# Altium project 2.3 - 28375D_Control_Card_2023.6.7.PrjPcb
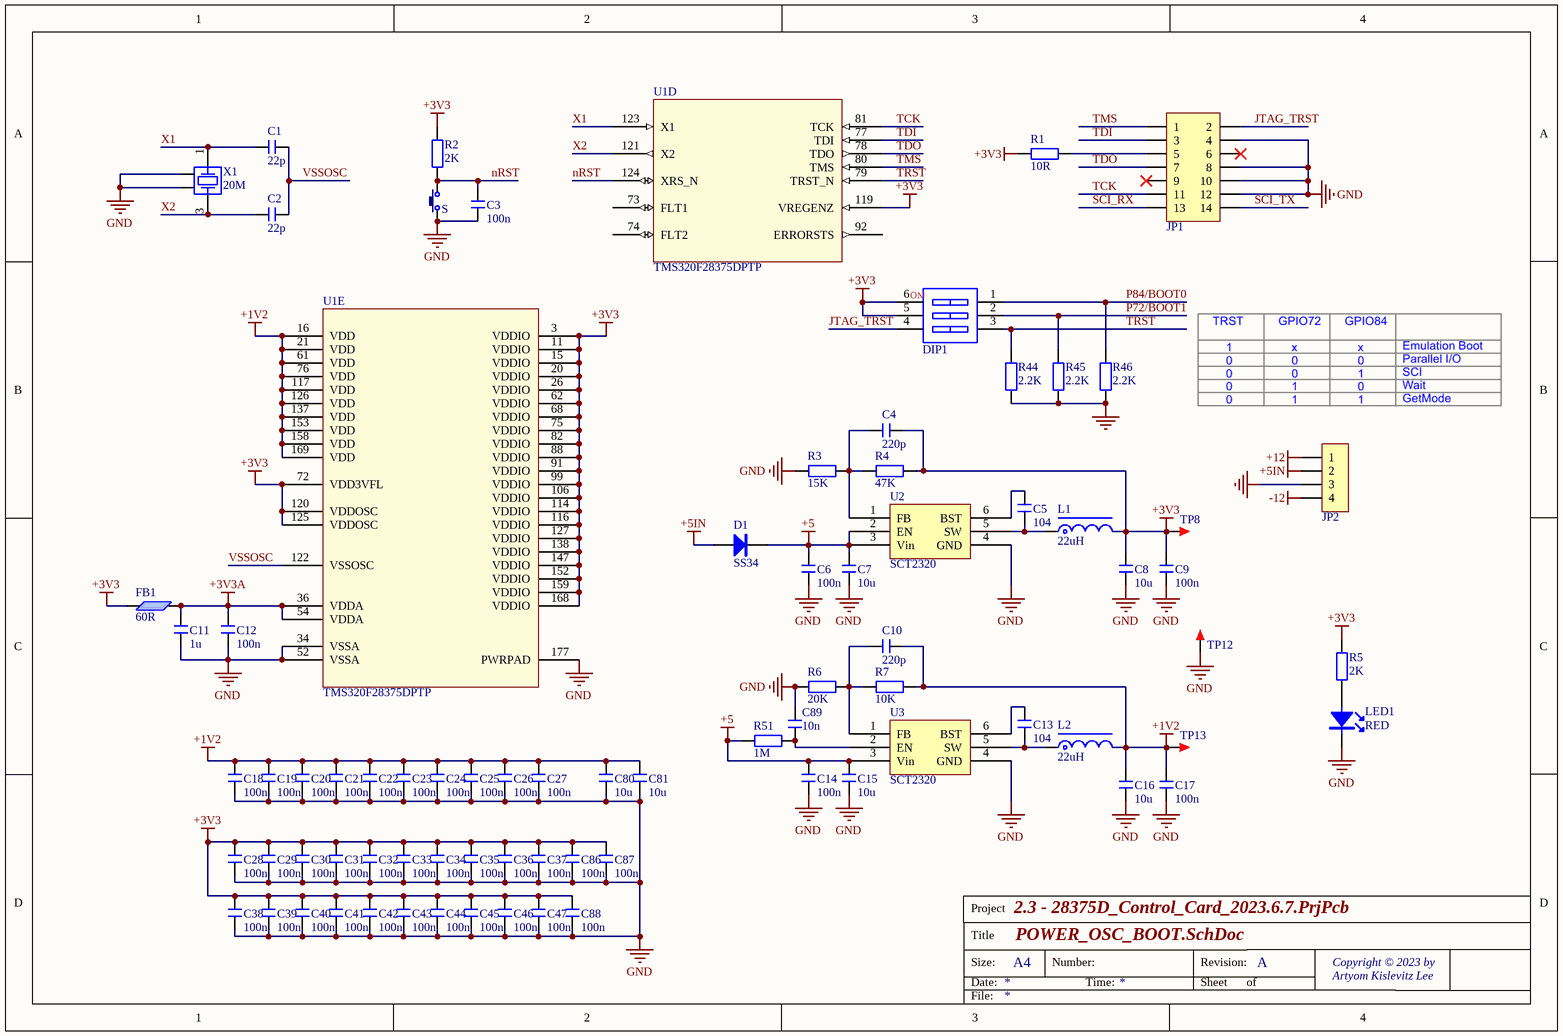
[diagram p0: POWER_OSC_BOOT.SchDoc]
5 sheets, 208 parts. Net scope: global (net labels, ports and power ports of the same name join across sheets).
Board file: 28375D_Control_Card_2023.6.7.PcbDoc
Sheets:
  POWER_OSC_BOOT.SchDoc
  AIO.SchDoc
  DIO.SchDoc
  CONDITIONING.SchDoc
  CONNECTOR_BUFFER.SchDoc

## Sheet POWER_OSC_BOOT.SchDoc
size A4; DrawnBy: Copyright © 2023 by; Engineer: Artyom Kislevitz Lee; Revision: A

### Parts
C1  22p  [C 0805_L]
C2  22p  [C 0805_L]
C3  100n  [C 0805_L]
C4  220p  [C 0805_L]
C5  104  [C 0805_L]
C6  100n  [C 0805_L]
C7  10u  [C 1210_L]
C8  10u  [C 1210_L]
C9  100n  [C 0805_L]
C10  220p  [C 0805_L]
C11  1u  [C 0805_L]
C12  100n  [C 0805_L]
C13  104  [C 0805_L]
C14  100n  [C 0805_L]
C15  10u  [C 1210_L]
C16  10u  [C 1210_L]
C17  100n  [C 0805_L]
C18  100n  [C 0603_L]
C19  100n  [C 0603_L]
C20  100n  [C 0603_L]
C21  100n  [C 0603_L]
C22  100n  [C 0603_L]
C23  100n  [C 0603_L]
C24  100n  [C 0603_L]
C25  100n  [C 0603_L]
C26  100n  [C 0603_L]
C27  100n  [C 0603_L]
C28  100n  [C 0603_L]
C29  100n  [C 0603_L]
C30  100n  [C 0603_L]
C31  100n  [C 0603_L]
C32  100n  [C 0603_L]
C33  100n  [C 0603_L]
C34  100n  [C 0603_L]
C35  100n  [C 0603_L]
C36  100n  [C 0603_L]
C37  100n  [C 0603_L]
C38  100n  [C 0603_L]
C39  100n  [C 0603_L]
C40  100n  [C 0603_L]
C41  100n  [C 0603_L]
C42  100n  [C 0603_L]
C43  100n  [C 0603_L]
C44  100n  [C 0603_L]
C45  100n  [C 0603_L]
C46  100n  [C 0603_L]
C47  100n  [C 0603_L]
C80  10u  [C 0805_L]
C81  10u  [C 0805_L]
C86  100n  [C 0603_L]
C87  100n  [C 0603_L]
C88  100n  [C 0603_L]
C89  10n  [C 0805_L]
D1  SS34  [SMA]
DIP1  SW-3P  [CSW1.27 SMD-3P]  (value not drawn)
FB1  60R  [R 0805_L]
JP1  Header 2X7  [IDC2.54-LI-2x7P]  (value not drawn)
JP2  HDR-1X4  [KF2510-LI-4P]  (value not drawn)
L1  22uH  [CDRH74]
L2  22uH  [CDRH74]
LED1  RED  [LED 0805R]
R1  10R  [R 0805_L]
R2  2K  [R 0805_L]
R3  15K  [R 0805_L]
R4  47K  [R 0805_L]
R5  2K  [R 0805_L]
R6  20K  [R 0805_L]
R7  10K  [R 0805_L]
R44  2.2K  [R 0805_L]
R45  2.2K  [R 0805_L]
R46  2.2K  [R 0805_L]
R51  1M  [R 0805_L]
S  3x6x5  [TSW DIP-3*6*4.3]  (value not drawn)
TP8  TEST  [TEST 1.6]  (value not drawn)
TP12  TEST  [TEST 1.6]  (value not drawn)
TP13  TEST  [TEST 1.6]  (value not drawn)
U1  TMS320F28375DPTP  [LQFP176-E 24x24_N]  (parts D,E of 5)
U2  SCT2320  [SOT23-6]
U3  SCT2320  [SOT23-6]
X1  20M  [OSC 3225-4P]

### Nets
+1V2: C10.2 C16.2 C17.2 C18.2 C19.2 C20.2 C21.2 C22.2 C23.2 C24.2 C25.2 C26.2 C27.2 C80.2 C81.2 L2.2 R7.2 TP13.1 U1.16(VDD) U1.21(VDD) U1.61(VDD) U1.76(VDD) U1.117(VDD) U1.126(VDD) U1.137(VDD) U1.153(VDD) U1.158(VDD) U1.169(VDD)
+3V3: C4.2 C8.2 C9.2 C28.2 C29.2 C30.2 C31.2 C32.2 C33.2 C34.2 C35.2 C36.2 C37.2 C38.2 C39.2 C40.2 C41.2 C42.2 C43.2 C44.2 C45.2 C46.2 C47.2 C86.2 C87.2 C88.2 DIP1.5 DIP1.6 FB1.1 L1.2 R1.2 R2.2 R4.2 R5.2 TP8.1 U1.3(VDDIO) U1.11(VDDIO) U1.15(VDDIO) U1.20(VDDIO) U1.26(VDDIO) U1.62(VDDIO) U1.68(VDDIO) U1.72(VDD3VFL) U1.75(VDDIO) U1.82(VDDIO) U1.88(VDDIO) U1.91(VDDIO) U1.99(VDDIO) U1.106(VDDIO) U1.114(VDDIO) U1.116(VDDIO) U1.119(VREGENZ) U1.120(VDDOSC) U1.125(VDDOSC) U1.127(VDDIO) U1.138(VDDIO) U1.147(VDDIO) U1.152(VDDIO) U1.159(VDDIO) U1.168(VDDIO)
+3V3A: C11.2 C12.2 FB1.2 U1.36(VDDA) U1.54(VDDA)
+5: C6.2 C7.2 C14.2 C15.2 D1.2(K) R51.1 U2.2(EN) U2.3(Vin) U3.3(Vin)
+5IN: D1.1(A) JP2.2
+12: JP2.1
-12: JP2.4
GND: C3.1 C6.1 C7.1 C8.1 C9.1 C11.1 C12.1 C14.1 C15.1 C16.1 C17.1 C18.1 C19.1 C20.1 C21.1 C22.1 C23.1 C24.1 C25.1 C26.1 C27.1 C28.1 C29.1 C30.1 C31.1 C32.1 C33.1 C34.1 C35.1 C36.1 C37.1 C38.1 C39.1 C40.1 C41.1 C42.1 C43.1 C44.1 C45.1 C46.1 C47.1 C80.1 C81.1 C86.1 C87.1 C88.1 C89.2 JP1.4 JP1.8 JP1.10 JP1.12 JP2.3 LED1.2(K) R3.1 R6.1 R44.2 R45.2 R46.2 S.1 TP12.1 U1.34(VSSA) U1.52(VSSA) U1.177(PWRPAD) U2.4(GND) U3.4(GND) X1.2 X1.4
JTAG_TRST: DIP1.4 JP1.2
nRST: C3.2 R2.1 S.2 U1.124(XRS_N)
P72/BOOT1: DIP1.2 R45.1
P84/BOOT0: DIP1.1 R46.1
SCI_RX: JP1.13
SCI_TX: JP1.14
TCK: JP1.11 U1.81(TCK)
TDI: JP1.3 U1.77(TDI)
TDO: JP1.7 U1.78(TDO)
TMS: JP1.1 U1.80(TMS)
TRST: DIP1.3 R44.1 U1.79(TRST_N)
VSSOSC: C1.1 C2.1 U1.122(VSSOSC)
X1: C1.2 U1.123(X1) X1.1
X2: C2.2 U1.121(X2) X1.3
NetC4_1: C4.1 R3.2 R4.1 U2.1(FB)
NetC5_1: C5.1 U2.6(BST)
NetC5_2: C5.2 L1.1 U2.5(SW)
NetC10_1: C10.1 R6.2 R7.1 U3.1(FB)
NetC13_1: C13.1 U3.6(BST)
NetC13_2: C13.2 L2.1 U3.5(SW)
NetC89_1: C89.1 R51.2 U3.2(EN)
NetJP1_5: JP1.5 R1.1
NetLED1_1: LED1.1(A) R5.1

Not connected (* = marked no-connect by the designer): JP1 6* 9*; U1 73(FLT1) 74(FLT2) 92(ERRORSTS)

### Notes on the sheet
- Project
- Title
- Size:
- Date:
- A4
- Number:
- Time:
- Revision:
- Sheet
- of
- Copyright © 2023 by
- Artyom Kislevitz Lee
- File:
- (in symbol SW-3P) NO

### Library data of the parts
C1-C47 C80 C81 C86-C89 = C: 贴片电容; 淘宝ID: 小糖豆的小窝窝; BOM名称: 贴片电容; 下单链接: https://item.taobao.com/item.htm?ft=t&id=613637044352
D1 = 1N4007: 整流二极管; 淘宝ID: 小糖豆的小窝窝; BOM名称: 整流二极管; 下单链接: https://item.taobao.com/item.htm?ft=t&id=613637044352
DIP1 = SW-3P: 3路编码开关; 淘宝ID: 小糖豆的小窝窝; BOM名称: 3路编码开关; 下单链接: https://item.taobao.com/item.htm?ft=t&id=613637044352
FB1 = FB: 磁珠; BOM名称: 贴片磁珠
JP1 = Header 7X2: 7*2P接插件; 淘宝ID: 小糖豆的小窝窝; BOM名称: 7*2P接插件; 下单链接: https://item.taobao.com/item.htm?ft=t&id=613637044352
JP2 = Header 4: 4P接插件; 淘宝ID: 小糖豆的小窝窝; BOM名称: 4P接插件; 下单链接: https://item.taobao.com/item.htm?ft=t&id=613637044352
L1 L2 = L-CDRH: 功率屏蔽电感; 淘宝ID: 小糖豆的小窝窝; BOM名称: 功率屏蔽电感; 下单链接: https://item.taobao.com/item.htm?ft=t&id=613637044352
LED1 = LED-SMD: 贴片LED; 淘宝ID: 小糖豆的小窝窝; BOM名称: 贴片LED; 下单链接: https://item.taobao.com/item.htm?ft=t&id=613637044352
R1-R7 R44-R46 R51 = R: 贴片电阻; 淘宝ID: 小糖豆的小窝窝; BOM名称: 贴片电阻; 下单链接: https://item.taobao.com/item.htm?ft=t&id=613637044352
S = TSW 3x6: 3x6轻触开关; 淘宝ID: 小糖豆的小窝窝; BOM名称: 3x6轻触开关; 下单链接: https://item.taobao.com/item.htm?ft=t&id=613637044352
TP8 TP12 TP13 = TEST: 测试点; 淘宝ID: 小糖豆的小窝窝; BOM名称: 测试点; 下单链接: https://item.taobao.com/item.htm?ft=t&id=613637044352
U1 = TMS320F28377DPTP: DSP 176; Manufacturer: Texas Instruments; CompType: IC; PIN_COUNT: 177; PartNumber: TMS320F28377DPTP; PackageReference: PTP0176F; MountType: SMT; RoHS: Y; RefDes: RefDes; Type: DEV; Value: Value
U2 U3 = SCT2330
X1 = XTAL-4P: 4脚无源晶振; 淘宝ID: 小糖豆的小窝窝; BOM名称: 4脚无源晶振; 下单链接: https://item.taobao.com/item.htm?ft=t&id=613637044352

## Sheet AIO.SchDoc
size A4; DrawnBy: Copyright © 2023 by; Engineer: Artyom Kislevitz Lee; Revision: A
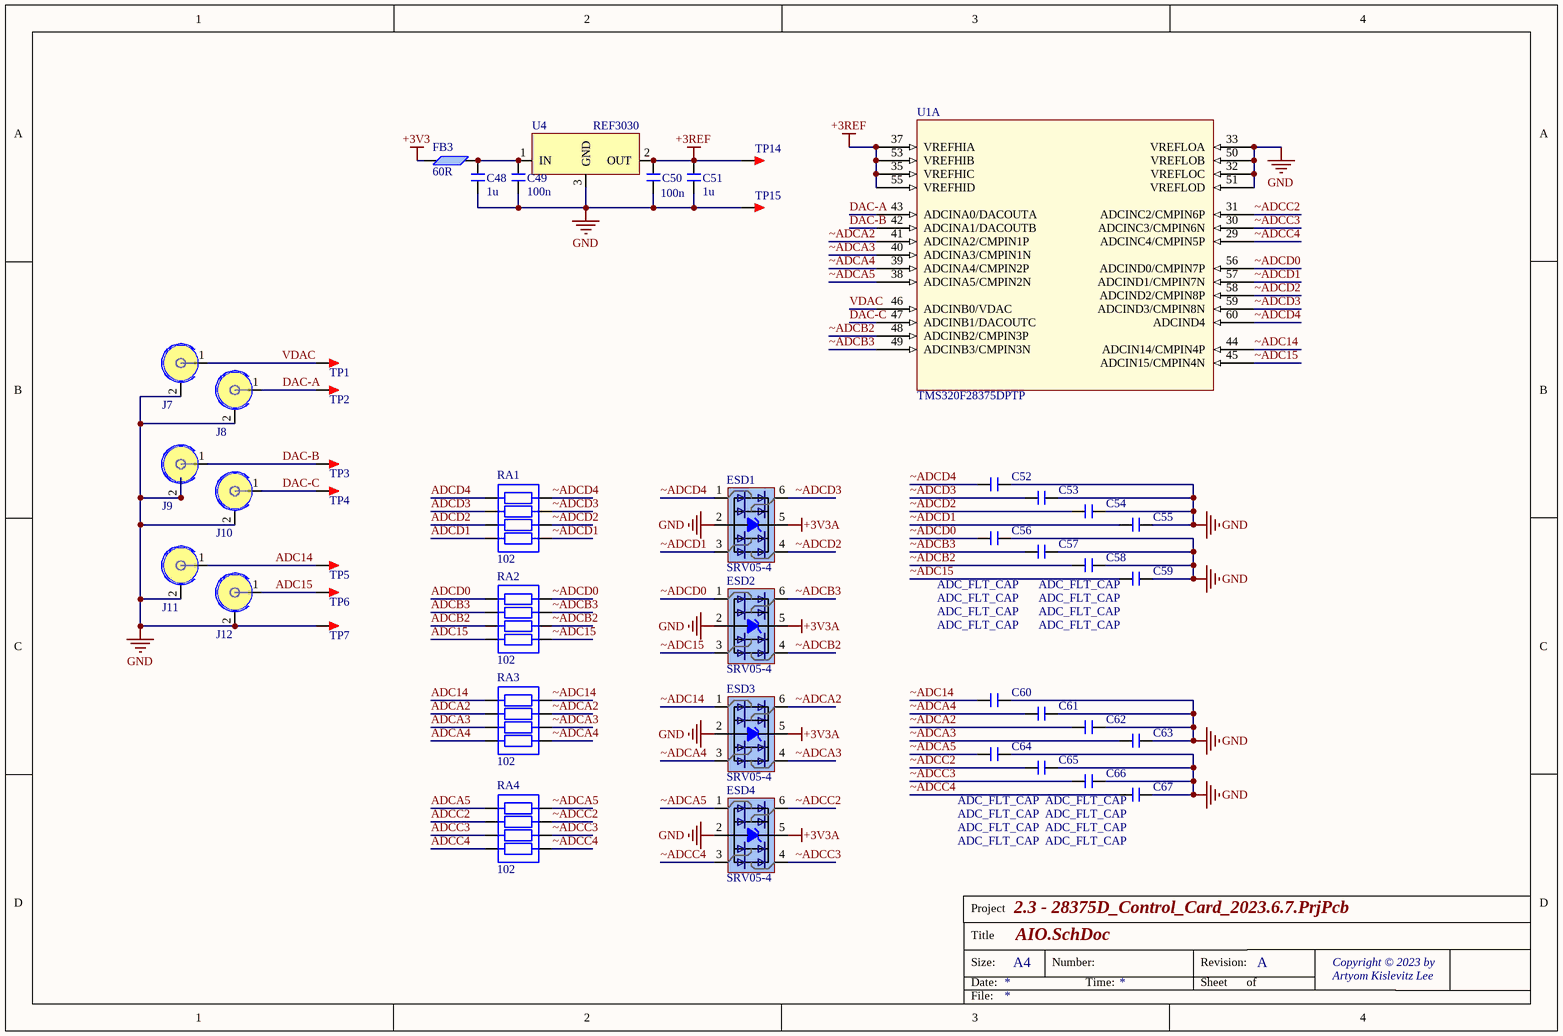
[diagram p1: AIO.SchDoc]

### Parts
C48  1u  [C 0805_L]
C49  100n  [C 0805_L]
C50  100n  [C 0805_L]
C51  1u  [C 0805_L]
C52  ADC_FLT_CAP  [C 0805_L]
C53  ADC_FLT_CAP  [C 0805_L]
C54  ADC_FLT_CAP  [C 0805_L]
C55  ADC_FLT_CAP  [C 0805_L]
C56  ADC_FLT_CAP  [C 0805_L]
C57  ADC_FLT_CAP  [C 0805_L]
C58  ADC_FLT_CAP  [C 0805_L]
C59  ADC_FLT_CAP  [C 0805_L]
C60  ADC_FLT_CAP  [C 0805_L]
C61  ADC_FLT_CAP  [C 0805_L]
C62  ADC_FLT_CAP  [C 0805_L]
C63  ADC_FLT_CAP  [C 0805_L]
C64  ADC_FLT_CAP  [C 0805_L]
C65  ADC_FLT_CAP  [C 0805_L]
C66  ADC_FLT_CAP  [C 0805_L]
C67  ADC_FLT_CAP  [C 0805_L]
ESD1  SRV05-4  [SOT23-6L]
ESD2  SRV05-4  [SOT23-6L]
ESD3  SRV05-4  [SOT23-6L]
ESD4  SRV05-4  [SOT23-6L]
FB3  60R  [R 0805_L]
J7  射频连接器  [IPEX-1]  (value not drawn)
J8  射频连接器  [IPEX-1]  (value not drawn)
J9  射频连接器  [IPEX-1]  (value not drawn)
J10  射频连接器  [IPEX-1]  (value not drawn)
J11  射频连接器  [IPEX-1]  (value not drawn)
J12  射频连接器  [IPEX-1]  (value not drawn)
RA1  102  [RCA-8P4R-0603]
RA2  102  [RCA-8P4R-0603]
RA3  102  [RCA-8P4R-0603]
RA4  102  [RCA-8P4R-0603]
TP1  TEST TP  [TEST TP1.4_W]  (value not drawn)
TP2  TEST TP  [TEST TP1.4_Y]  (value not drawn)
TP3  TEST TP  [TEST TP1.4_Y]  (value not drawn)
TP4  TEST TP  [TEST TP1.4_Y]  (value not drawn)
TP5  TEST TP  [TEST TP1.4_G]  (value not drawn)
TP6  TEST TP  [TEST TP1.4_G]  (value not drawn)
TP7  TEST TP  [TEST TP1.4_B]  (value not drawn)
TP14  TEST  [TEST 1.6]  (value not drawn)
TP15  TEST  [TEST 1.6]  (value not drawn)
U1  TMS320F28375DPTP  [LQFP176-E 24x24_N]  (part A of 5)
U4  REF3030  [SOT23-3L]

### Nets
+3REF: C50.2 C51.2 TP14.1 U1.35(VREFHIC) U1.37(VREFHIA) U1.53(VREFHIB) U1.55(VREFHID) U4.2(OUT)
+3V3: FB3.1
+3V3A: ESD1.5(EPAD) ESD2.5(EPAD) ESD3.5(EPAD) ESD4.5(EPAD)
GND: C48.1 C49.1 C50.1 C51.1 C52.1 C53.1 C54.1 C55.1 C56.1 C57.1 C58.1 C59.1 C60.1 C61.1 C62.1 C63.1 C64.1 C65.1 C66.1 C67.1 ESD1.2(EPAD) ESD2.2(EPAD) ESD3.2(EPAD) ESD4.2(EPAD) J7.2(GND) J8.2(GND) J9.2(GND) J10.2(GND) J11.2(GND) J12.2(GND) TP7.1 TP15.1 U1.32(VREFLOC) U1.33(VREFLOA) U1.50(VREFLOB) U1.51(VREFLOD) U4.3(GND)
ADC14: J11.1(SIG) RA3.8 TP5.1
ADC15: J12.1(SIG) RA2.5 TP6.1
ADCA2: RA3.7
ADCA3: RA3.6
ADCA4: RA3.5
ADCA5: RA4.8
ADCB2: RA2.6
ADCB3: RA2.7
ADCC2: RA4.7
ADCC3: RA4.6
ADCC4: RA4.5
ADCD0: RA2.8
ADCD1: RA1.5
ADCD2: RA1.6
ADCD3: RA1.7
ADCD4: RA1.8
DAC-A: J8.1(SIG) TP2.1 U1.43(ADCINA0/DACOUTA)
DAC-B: J9.1(SIG) TP3.1 U1.42(ADCINA1/DACOUTB)
DAC-C: J10.1(SIG) TP4.1 U1.47(ADCINB1/DACOUTC)
VDAC: J7.1(SIG) TP1.1 U1.46(ADCINB0/VDAC)
~ADC14: C60.2 ESD3.1(EPAD) RA3.1 U1.44(ADCIN14/CMPIN4P)
~ADC15: C59.2 ESD2.3(EPAD) RA2.4 U1.45(ADCIN15/CMPIN4N)
~ADCA2: C62.2 ESD3.6(EPAD) RA3.2 U1.41(ADCINA2/CMPIN1P)
~ADCA3: C63.2 ESD3.4(EPAD) RA3.3 U1.40(ADCINA3/CMPIN1N)
~ADCA4: C61.2 ESD3.3(EPAD) RA3.4 U1.39(ADCINA4/CMPIN2P)
~ADCA5: C64.2 ESD4.1(EPAD) RA4.1 U1.38(ADCINA5/CMPIN2N)
~ADCB2: C58.2 ESD2.4(EPAD) RA2.3 U1.48(ADCINB2/CMPIN3P)
~ADCB3: C57.2 ESD2.6(EPAD) RA2.2 U1.49(ADCINB3/CMPIN3N)
~ADCC2: C65.2 ESD4.6(EPAD) RA4.2 U1.31(ADCINC2/CMPIN6P)
~ADCC3: C66.2 ESD4.4(EPAD) RA4.3 U1.30(ADCINC3/CMPIN6N)
~ADCC4: C67.2 ESD4.3(EPAD) RA4.4 U1.29(ADCINC4/CMPIN5P)
~ADCD0: C56.2 ESD2.1(EPAD) RA2.1 U1.56(ADCIND0/CMPIN7P)
~ADCD1: C55.2 ESD1.3(EPAD) RA1.4 U1.57(ADCIND1/CMPIN7N)
~ADCD2: C54.2 ESD1.4(EPAD) RA1.3 U1.58(ADCIND2/CMPIN8P)
~ADCD3: C53.2 ESD1.6(EPAD) RA1.2 U1.59(ADCIND3/CMPIN8N)
~ADCD4: C52.2 ESD1.1(EPAD) RA1.1 U1.60(ADCIND4)
NetC48_2: C48.2 C49.2 FB3.2 U4.1(IN)

### Notes on the sheet
- Project
- Title
- Size:
- Date:
- A4
- Number:
- Time:
- Revision:
- Sheet
- of
- Copyright © 2023 by
- Artyom Kislevitz Lee
- File:

### Library data of the parts
C48-C67 = C: 贴片电容; 淘宝ID: 小糖豆的小窝窝; BOM名称: 贴片电容; 下单链接: https://item.taobao.com/item.htm?ft=t&id=613637044352
ESD1-ESD4 = ESD - 4
FB3 = FB: 磁珠; BOM名称: 贴片磁珠
J7-J12 = 射频连接器: 射频连接器 RF connector
RA1-RA4 = R-8P4R: 贴片排阻; 淘宝ID: 小糖豆的小窝窝; BOM名称: 贴片排阻; 下单链接: https://item.taobao.com/item.htm?ft=t&id=613637044352
TP1-TP7 = TEST TP: 测试环; 淘宝ID: 小糖豆的小窝窝; BOM名称: 测试环; 下单链接: https://item.taobao.com/item.htm?ft=t&id=613637044352
TP14 TP15 = TEST: 测试点; 淘宝ID: 小糖豆的小窝窝; BOM名称: 测试点; 下单链接: https://item.taobao.com/item.htm?ft=t&id=613637044352
U1 = TMS320F28377DPTP: as U1 on sheet POWER_OSC_BOOT; PartNumber: TMS320F28377DPTP; PackageReference: PTP0176F; MountType: SMT; RoHS: Y; RefDes: RefDes; Type: DEV; Value: Value

## Sheet DIO.SchDoc
size A4; DrawnBy: Copyright © 2023 by; Engineer: Artyom Kislevitz Lee; Revision: A
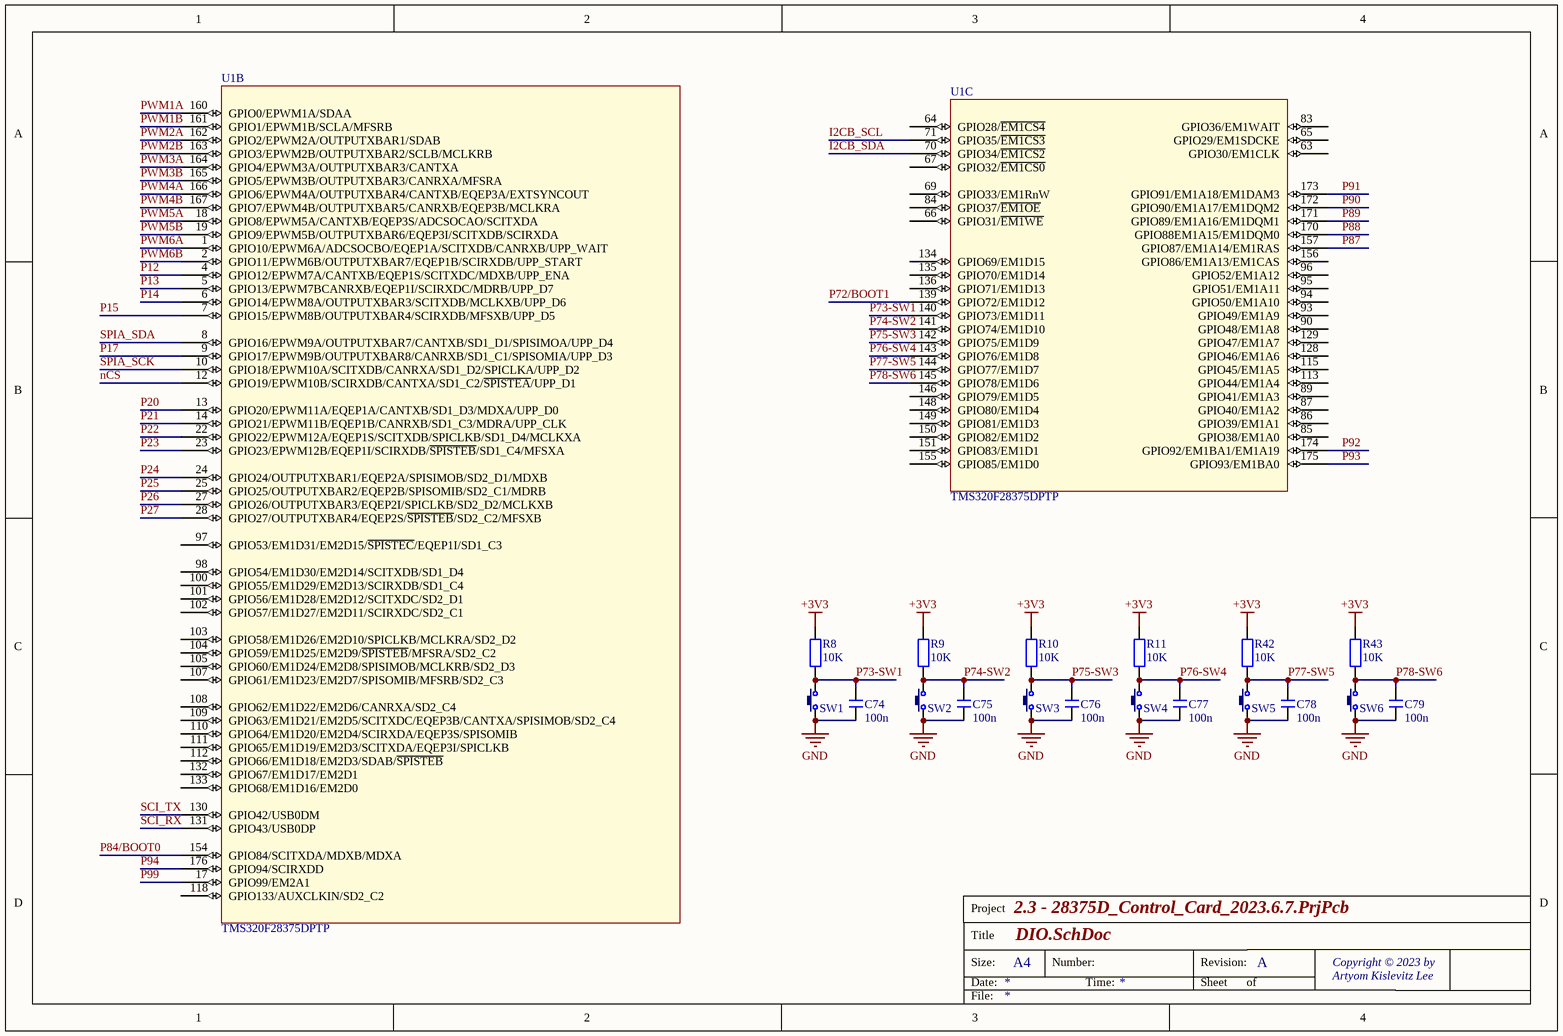
[diagram p2: DIO.SchDoc]

### Parts
C74  100n  [C 0805_L]
C75  100n  [C 0805_L]
C76  100n  [C 0805_L]
C77  100n  [C 0805_L]
C78  100n  [C 0805_L]
C79  100n  [C 0805_L]
R8  10K  [R 0805_L]
R9  10K  [R 0805_L]
R10  10K  [R 0805_L]
R11  10K  [R 0805_L]
R42  10K  [R 0805_L]
R43  10K  [R 0805_L]
SW1  3x6x5  [TSW DIP-3*6*4.3]  (value not drawn)
SW2  3x6x5  [TSW DIP-3*6*4.3]  (value not drawn)
SW3  3x6x5  [TSW DIP-3*6*4.3]  (value not drawn)
SW4  3x6x5  [TSW DIP-3*6*4.3]  (value not drawn)
SW5  3x6x5  [TSW DIP-3*6*4.3]  (value not drawn)
SW6  3x6x5  [TSW DIP-3*6*4.3]  (value not drawn)
U1  TMS320F28375DPTP  [LQFP176-E 24x24_N]  (parts B,C of 5)

### Nets
+3V3: R8.2 R9.2 R10.2 R11.2 R42.2 R43.2
GND: C74.1 C75.1 C76.1 C77.1 C78.1 C79.1 SW1.1 SW2.1 SW3.1 SW4.1 SW5.1 SW6.1
I2CB_SCL: U1.71(GPIO35/~{EM1CS3})
I2CB_SDA: U1.70(GPIO34/~{EM1CS2})
nCS: U1.12(GPIO19/EPWM10B/SCIRXDB/CANTXA/SD1_C2/~{SPISTEA}/UPP_D1)
P12: U1.4(GPIO12/EPWM7A/CANTXB/EQEP1S/SCITXDC/MDXB/UPP_ENA)
P13: U1.5(GPIO13/EPWM7BCANRXB/EQEP1I/SCIRXDC/MDRB/UPP_D7)
P14: U1.6(GPIO14/EPWM8A/OUTPUTXBAR3/SCITXDB/MCLKXB/UPP_D6)
P15: U1.7(GPIO15/EPWM8B/OUTPUTXBAR4/SCIRXDB/MFSXB/UPP_D5)
P17: U1.9(GPIO17/EPWM9B/OUTPUTXBAR8/CANRXB/SD1_C1/SPISOMIA/UPP_D3)
P20: U1.13(GPIO20/EPWM11A/EQEP1A/CANTXB/SD1_D3/MDXA/UPP_D0)
P21: U1.14(GPIO21/EPWM11B/EQEP1B/CANRXB/SD1_C3/MDRA/UPP_CLK)
P22: U1.22(GPIO22/EPWM12A/EQEP1S/SCITXDB/SPICLKB/SD1_D4/MCLKXA)
P23: U1.23(GPIO23/EPWM12B/EQEP1I/SCIRXDB/~{SPISTEB}/SD1_C4/MFSXA)
P24: U1.24(GPIO24/OUTPUTXBAR1/EQEP2A/SPISIMOB/SD2_D1/MDXB)
P25: U1.25(GPIO25/OUTPUTXBAR2/EQEP2B/SPISOMIB/SD2_C1/MDRB)
P26: U1.27(GPIO26/OUTPUTXBAR3/EQEP2I/SPICLKB/SD2_D2/MCLKXB)
P27: U1.28(GPIO27/OUTPUTXBAR4/EQEP2S/~{SPISTEB}/SD2_C2/MFSXB)
P72/BOOT1: U1.139(GPIO72/EM1D12)
P73-SW1: C74.2 R8.1 SW1.2 U1.140(GPIO73/EM1D11)
P74-SW2: C75.2 R9.1 SW2.2 U1.141(GPIO74/EM1D10)
P75-SW3: C76.2 R10.1 SW3.2 U1.142(GPIO75/EM1D9)
P76-SW4: C77.2 R11.1 SW4.2 U1.143(GPIO76/EM1D8)
P77-SW5: C78.2 R42.1 SW5.2 U1.144(GPIO77/EM1D7)
P78-SW6: C79.2 R43.1 SW6.2 U1.145(GPIO78/EM1D6)
P84/BOOT0: U1.154(GPIO84/SCITXDA/MDXB/MDXA)
P87: U1.157(GPIO87/EM1A14/EM1RAS)
P88: U1.170(GPIO88EM1A15/EM1DQM0)
P89: U1.171(GPIO89/EM1A16/EM1DQM1)
P90: U1.172(GPIO90/EM1A17/EM1DQM2)
P91: U1.173(GPIO91/EM1A18/EM1DAM3)
P92: U1.174(GPIO92/EM1BA1/EM1A19)
P93: U1.175(GPIO93/EM1BA0)
P94: U1.176(GPIO94/SCIRXDD)
P99: U1.17(GPIO99/EM2A1)
PWM1A: U1.160(GPIO0/EPWM1A/SDAA)
PWM1B: U1.161(GPIO1/EPWM1B/SCLA/MFSRB)
PWM2A: U1.162(GPIO2/EPWM2A/OUTPUTXBAR1/SDAB)
PWM2B: U1.163(GPIO3/EPWM2B/OUTPUTXBAR2/SCLB/MCLKRB)
PWM3A: U1.164(GPIO4/EPWM3A/OUTPUTXBAR3/CANTXA)
PWM3B: U1.165(GPIO5/EPWM3B/OUTPUTXBAR3/CANRXA/MFSRA)
PWM4A: U1.166(GPIO6/EPWM4A/OUTPUTXBAR4/CANTXB/EQEP3A/EXTSYNCOUT)
PWM4B: U1.167(GPIO7/EPWM4B/OUTPUTXBAR5/CANRXB/EQEP3B/MCLKRA)
PWM5A: U1.18(GPIO8/EPWM5A/CANTXB/EQEP3S/ADCSOCAO/SCITXDA)
PWM5B: U1.19(GPIO9/EPWM5B/OUTPUTXBAR6/EQEP3I/SCITXDB/SCIRXDA)
PWM6A: U1.1(GPIO10/EPWM6A/ADCSOCBO/EQEP1A/SCITXDB/CANRXB/UPP_WAIT)
PWM6B: U1.2(GPIO11/EPWM6B/OUTPUTXBAR7/EQEP1B/SCIRXDB/UPP_START)
SCI_RX: U1.131(GPIO43/USB0DP)
SCI_TX: U1.130(GPIO42/USB0DM)
SPIA_SCK: U1.10(GPIO18/EPWM10A/SCITXDB/CANRXA/SD1_D2/SPICLKA/UPP_D2)
SPIA_SDA: U1.8(GPIO16/EPWM9A/OUTPUTXBAR7/CANTXB/SD1_D1/SPISIMOA/UPP_D4)

Not connected (* = marked no-connect by the designer): U1 63(GPIO30/EM1CLK) 64(GPIO28/~{EM1CS4}) 65(GPIO29/EM1SDCKE) 66(GPIO31/~{EM1WE}) 67(GPIO32/~{EM1CS0}) 69(GPIO33/EM1RnW) 83(GPIO36/EM1WAIT) 84(GPIO37/~{EM1OE}) 85(GPIO38/EM1A0) 86(GPIO39/EM1A1) 87(GPIO40/EM1A2) 89(GPIO41/EM1A3) 90(GPIO48/EM1A8) 93(GPIO49/EM1A9) 94(GPIO50/EM1A10) 95(GPIO51/EM1A11) 96(GPIO52/EM1A12) 97(GPIO53/EM1D31/EM2D15/~{SPISTEC}/EQEP1I/SD1_C3) 98(GPIO54/EM1D30/EM2D14/SCITXDB/SD1_D4) 100(GPIO55/EM1D29/EM2D13/SCIRXDB/SD1_C4) 101(GPIO56/EM1D28/EM2D12/SCITXDC/SD2_D1) 102(GPIO57/EM1D27/EM2D11/SCIRXDC/SD2_C1) 103(GPIO58/EM1D26/EM2D10/SPICLKB/MCLKRA/SD2_D2) 104(GPIO59/EM1D25/EM2D9/~{SPISTEB}/MFSRA/SD2_C2) 105(GPIO60/EM1D24/EM2D8/SPISIMOB/MCLKRB/SD2_D3) 107(GPIO61/EM1D23/EM2D7/SPISOMIB/MFSRB/SD2_C3) 108(GPIO62/EM1D22/EM2D6/CANRXA/SD2_C4) 109(GPIO63/EM1D21/EM2D5/SCITXDC/EQEP3B/CANTXA/SPISIMOB/SD2_C4) 110(GPIO64/EM1D20/EM2D4/SCIRXDA/EQEP3S/SPISOMIB) 111(GPIO65/EM1D19/EM2D3/SCITXDA/EQEP3I/SPICLKB) 112(GPIO66/EM1D18/EM2D3/SDAB/~{SPISTEB}) 113(GPIO44/EM1A4) 115(GPIO45/EM1A5) 118(GPIO133/AUXCLKIN/SD2_C2) 128(GPIO46/EM1A6) 129(GPIO47/EM1A7) 132(GPIO67/EM1D17/EM2D1) 133(GPIO68/EM1D16/EM2D0) 134(GPIO69/EM1D15) 135(GPIO70/EM1D14) 136(GPIO71/EM1D13) 146(GPIO79/EM1D5) 148(GPIO80/EM1D4) 149(GPIO81/EM1D3) 150(GPIO82/EM1D2) 151(GPIO83/EM1D1) 155(GPIO85/EM1D0) 156(GPIO86/EM1A13/EM1CAS)

### Notes on the sheet
- Project
- Title
- Size:
- Date:
- A4
- Number:
- Time:
- Revision:
- Sheet
- of
- Copyright © 2023 by
- Artyom Kislevitz Lee
- File:

### Library data of the parts
C74-C79 = C: 贴片电容; 淘宝ID: 小糖豆的小窝窝; BOM名称: 贴片电容; 下单链接: https://item.taobao.com/item.htm?ft=t&id=613637044352
R8-R11 R42 R43 = R: 贴片电阻; 淘宝ID: 小糖豆的小窝窝; BOM名称: 贴片电阻; 下单链接: https://item.taobao.com/item.htm?ft=t&id=613637044352
SW1-SW6 = TSW 3x6: 3x6轻触开关; 淘宝ID: 小糖豆的小窝窝; BOM名称: 3x6轻触开关; 下单链接: https://item.taobao.com/item.htm?ft=t&id=613637044352
U1 = TMS320F28377DPTP: as U1 on sheet POWER_OSC_BOOT; PartNumber: TMS320F28377DPTP; PackageReference: PTP0176F; MountType: SMT; RoHS: Y; RefDes: RefDes; Type: DEV; Value: Value

## Sheet CONDITIONING.SchDoc
size A4; DrawnBy: Copyright © 2023 by; Engineer: Artyom Kislevitz Lee; Revision: A
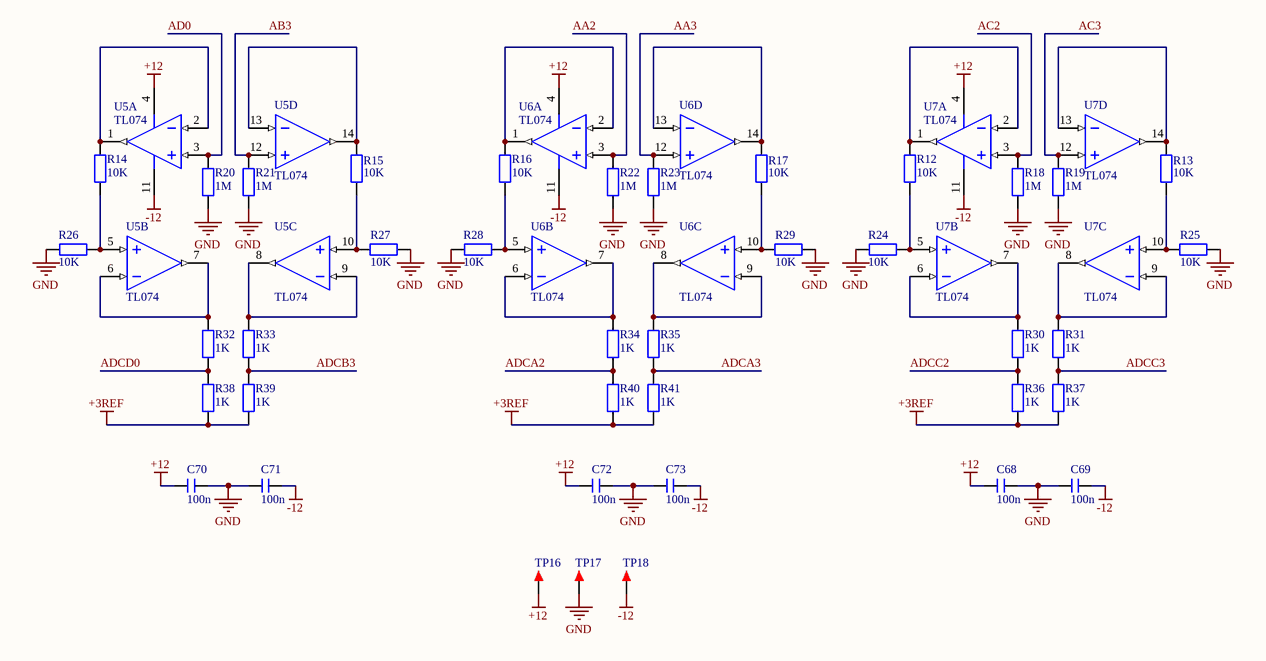
[diagram p3: CONDITIONING.SchDoc]

### Parts
C68  100n  [C 0805_L]
C69  100n  [C 0805_L]
C70  100n  [C 0805_L]
C71  100n  [C 0805_L]
C72  100n  [C 0805_L]
C73  100n  [C 0805_L]
R12  10K  [R 0805_L]
R13  10K  [R 0805_L]
R14  10K  [R 0805_L]
R15  10K  [R 0805_L]
R16  10K  [R 0805_L]
R17  10K  [R 0805_L]
R18  1M  [R 0805_L]
R19  1M  [R 0805_L]
R20  1M  [R 0805_L]
R21  1M  [R 0805_L]
R22  1M  [R 0805_L]
R23  1M  [R 0805_L]
R24  10K  [R 0805_L]
R25  10K  [R 0805_L]
R26  10K  [R 0805_L]
R27  10K  [R 0805_L]
R28  10K  [R 0805_L]
R29  10K  [R 0805_L]
R30  1K  [R 0805_L]
R31  1K  [R 0805_L]
R32  1K  [R 0805_L]
R33  1K  [R 0805_L]
R34  1K  [R 0805_L]
R35  1K  [R 0805_L]
R36  1K  [R 0805_L]
R37  1K  [R 0805_L]
R38  1K  [R 0805_L]
R39  1K  [R 0805_L]
R40  1K  [R 0805_L]
R41  1K  [R 0805_L]
TP16  TEST  [TEST 1]  (value not drawn)
TP17  TEST  [TEST 1]  (value not drawn)
TP18  TEST  [TEST 1]  (value not drawn)
U5  TL074  [SOP14_N]  (parts A,B,C,D of 4)
U6  TL074  [SOP14_N]  (parts A,B,C,D of 4)
U7  TL074  [SOP14_N]  (parts A,B,C,D of 4)

### Nets
+3REF: R36.1 R37.1 R38.1 R39.1 R40.1 R41.1
+12: C68.1 C70.1 C72.1 TP16.1 U5.4(VCC+) U6.4(VCC+) U7.4(VCC+)
-12: C69.2 C71.2 C73.2 TP18.1 U5.11(VCC-) U6.11(VCC-) U7.11(VCC-)
GND: C68.2 C69.1 C70.2 C71.1 C72.2 C73.1 R18.1 R19.1 R20.1 R21.1 R22.1 R23.1 R24.1 R25.1 R26.1 R27.1 R28.1 R29.1 TP17.1
AA2: R22.2 U6.3(IN1+)
AA3: R23.2 U6.12(IN3+)
AB3: R21.2 U5.12(IN3+)
AC2: R18.2 U7.3(IN1+)
AC3: R19.2 U7.12(IN3+)
AD0: R20.2 U5.3(IN1+)
ADCA2: R34.1 R40.2
ADCA3: R35.1 R41.2
ADCB3: R33.1 R39.2
ADCC2: R30.1 R36.2
ADCC3: R31.1 R37.2
ADCD0: R32.1 R38.2
NetR12_1: R12.1 R24.2 U7.5(IN2+)
NetR12_2: R12.2 U7.1(OUT) U7.2(IN1-)
NetR13_1: R13.1 R25.2 U7.10(IN4+)
NetR13_2: R13.2 U7.13(IN3-) U7.14(OUT)
NetR14_1: R14.1 R26.2 U5.5(IN2+)
NetR14_2: R14.2 U5.1(OUT) U5.2(IN1-)
NetR15_1: R15.1 R27.2 U5.10(IN4+)
NetR15_2: R15.2 U5.13(IN3-) U5.14(OUT)
NetR16_1: R16.1 R28.2 U6.5(IN2+)
NetR16_2: R16.2 U6.1(OUT) U6.2(IN1-)
NetR17_1: R17.1 R29.2 U6.10(IN4+)
NetR17_2: R17.2 U6.13(IN3-) U6.14(OUT)
NetR30_2: R30.2 U7.6(IN2-) U7.7(OUT)
NetR31_2: R31.2 U7.8(OUT) U7.9(IN4-)
NetR32_2: R32.2 U5.6(IN2-) U5.7(OUT)
NetR33_2: R33.2 U5.8(OUT) U5.9(IN4-)
NetR34_2: R34.2 U6.6(IN2-) U6.7(OUT)
NetR35_2: R35.2 U6.8(OUT) U6.9(IN4-)

### Notes on the sheet
- Project
- Title
- Size:
- Date:
- A4
- Number:
- Time:
- Revision:
- Sheet
- of
- Copyright © 2023 by
- Artyom Kislevitz Lee
- File:

### Library data of the parts
C68-C73 = C: 贴片电容; 淘宝ID: 小糖豆的小窝窝; BOM名称: 贴片电容; 下单链接: https://item.taobao.com/item.htm?ft=t&id=613637044352
R12-R41 = R: 贴片电阻; 淘宝ID: 小糖豆的小窝窝; BOM名称: 贴片电阻; 下单链接: https://item.taobao.com/item.htm?ft=t&id=613637044352
TP16-TP18 = TEST: 测试点; 淘宝ID: 小糖豆的小窝窝; BOM名称: 测试点; 下单链接: https://item.taobao.com/item.htm?ft=t&id=613637044352
U5-U7 = TL074: Low Noise JFET-Input Operational Amplifiers; 淘宝ID: 小糖豆的小窝窝; Alias1: https://item.taobao.com/item.htm?ft=t&id=613637044352; BOM名称: Low Noise JFET-Input Operational Amplifiers

## Sheet CONNECTOR_BUFFER.SchDoc
size A4; DrawnBy: Copyright © 2023 by; Engineer: Artyom Kislevitz Lee; Revision: A
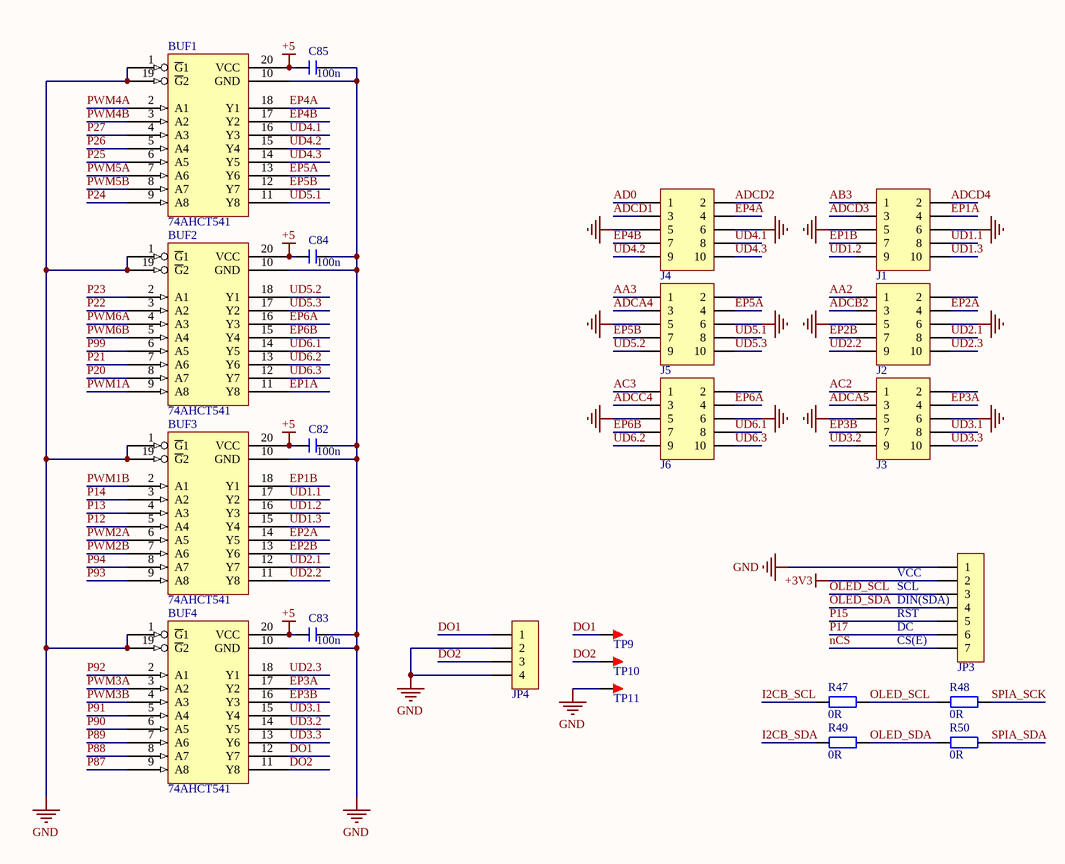
[diagram p4: CONNECTOR_BUFFER.SchDoc]

### Parts
BUF1  74AHCT541  [TSSOP20_N]
BUF2  74AHCT541  [TSSOP20_N]
BUF3  74AHCT541  [TSSOP20_N]
BUF4  74AHCT541  [TSSOP20_N]
C82  100n  [C 0805_L]
C83  100n  [C 0805_L]
C84  100n  [C 0805_L]
C85  100n  [C 0805_L]
J1  Header 5X2  [IDC2.54-LI-2x5P]  (value not drawn)
J2  Header 5X2  [IDC2.54-LI-2x5P]  (value not drawn)
J3  Header 5X2  [IDC2.54-LI-2x5P]  (value not drawn)
J4  Header 5X2  [IDC2.54-LI-2x5P]  (value not drawn)
J5  Header 5X2  [IDC2.54-LI-2x5P]  (value not drawn)
J6  Header 5X2  [IDC2.54-LI-2x5P]  (value not drawn)
JP3  HDR-1X7  [HDR2.54-M-LI-7P]  (value not drawn)
JP4  HDR-1X4  [HDR2.54-LI-4P]  (value not drawn)
R47  0R  [R 0805_L]
R48  0R  [R 0805_L]
R49  0R  [R 0805_L]
R50  0R  [R 0805_L]
TP9  TEST TP  [TEST TP1.4_B]  (value not drawn)
TP10  TEST TP  [TEST TP1.4_B]  (value not drawn)
TP11  TEST TP  [TEST TP1.4_B]  (value not drawn)

### Nets
+3V3: JP3.2
+5: BUF1.20(VCC) BUF2.20(VCC) BUF3.20(VCC) BUF4.20(VCC) C82.2 C83.2 C84.2 C85.2
GND: BUF1.1(~{G}1) BUF1.10(GND) BUF1.19(~{G}2) BUF2.1(~{G}1) BUF2.10(GND) BUF2.19(~{G}2) BUF3.1(~{G}1) BUF3.10(GND) BUF3.19(~{G}2) BUF4.1(~{G}1) BUF4.10(GND) BUF4.19(~{G}2) C82.1 C83.1 C84.1 C85.1 J1.5 J1.6 J2.5 J2.6 J3.5 J3.6 J4.5 J4.6 J5.5 J5.6 J6.5 J6.6 JP3.1 JP4.2 JP4.4 TP11.1
AA2: J2.1
AA3: J5.1
AB3: J1.1
AC2: J3.1
AC3: J6.1
AD0: J4.1
ADCA4: J5.3
ADCA5: J3.3
ADCB2: J2.3
ADCC4: J6.3
ADCD1: J4.3
ADCD2: J4.2
ADCD3: J1.3
ADCD4: J1.2
DO1: BUF4.12(Y7) JP4.1 TP9.1
DO2: BUF4.11(Y8) JP4.3 TP10.1
EP1A: BUF2.11(Y8) J1.4
EP1B: BUF3.18(Y1) J1.7
EP2A: BUF3.14(Y5) J2.4
EP2B: BUF3.13(Y6) J2.7
EP3A: BUF4.17(Y2) J3.4
EP3B: BUF4.16(Y3) J3.7
EP4A: BUF1.18(Y1) J4.4
EP4B: BUF1.17(Y2) J4.7
EP5A: BUF1.13(Y6) J5.4
EP5B: BUF1.12(Y7) J5.7
EP6A: BUF2.16(Y3) J6.4
EP6B: BUF2.15(Y4) J6.7
I2CB_SCL: R47.1
I2CB_SDA: R49.1
nCS: JP3.7
OLED_SCL: JP3.3 R47.2 R48.1
OLED_SDA: JP3.4 R49.2 R50.1
P12: BUF3.5(A4)
P13: BUF3.4(A3)
P14: BUF3.3(A2)
P15: JP3.5
P17: JP3.6
P20: BUF2.8(A7)
P21: BUF2.7(A6)
P22: BUF2.3(A2)
P23: BUF2.2(A1)
P24: BUF1.9(A8)
P25: BUF1.6(A5)
P26: BUF1.5(A4)
P27: BUF1.4(A3)
P87: BUF4.9(A8)
P88: BUF4.8(A7)
P89: BUF4.7(A6)
P90: BUF4.6(A5)
P91: BUF4.5(A4)
P92: BUF4.2(A1)
P93: BUF3.9(A8)
P94: BUF3.8(A7)
P99: BUF2.6(A5)
PWM1A: BUF2.9(A8)
PWM1B: BUF3.2(A1)
PWM2A: BUF3.6(A5)
PWM2B: BUF3.7(A6)
PWM3A: BUF4.3(A2)
PWM3B: BUF4.4(A3)
PWM4A: BUF1.2(A1)
PWM4B: BUF1.3(A2)
PWM5A: BUF1.7(A6)
PWM5B: BUF1.8(A7)
PWM6A: BUF2.4(A3)
PWM6B: BUF2.5(A4)
SPIA_SCK: R48.2
SPIA_SDA: R50.2
UD1.1: BUF3.17(Y2) J1.8
UD1.2: BUF3.16(Y3) J1.9
UD1.3: BUF3.15(Y4) J1.10
UD2.1: BUF3.12(Y7) J2.8
UD2.2: BUF3.11(Y8) J2.9
UD2.3: BUF4.18(Y1) J2.10
UD3.1: BUF4.15(Y4) J3.8
UD3.2: BUF4.14(Y5) J3.9
UD3.3: BUF4.13(Y6) J3.10
UD4.1: BUF1.16(Y3) J4.8
UD4.2: BUF1.15(Y4) J4.9
UD4.3: BUF1.14(Y5) J4.10
UD5.1: BUF1.11(Y8) J5.8
UD5.2: BUF2.18(Y1) J5.9
UD5.3: BUF2.17(Y2) J5.10
UD6.1: BUF2.14(Y5) J6.8
UD6.2: BUF2.13(Y6) J6.9
UD6.3: BUF2.12(Y7) J6.10

Not connected (* = marked no-connect by the designer): J2 2; J3 2; J5 2; J6 2

### Notes on the sheet
- (near JP3) VCC
- (near JP3) SCL
- (near JP3) DIN(SDA)
- (near JP3) RST
- (near JP3) CS(E)
- (near JP3) DC
- Project
- Title
- Size:
- Date:
- A4
- Number:
- Time:
- Revision:
- Sheet
- of
- Copyright © 2023 by
- Artyom Kislevitz Lee
- File:

### Library data of the parts
C82-C85 = C: 贴片电容; 淘宝ID: 小糖豆的小窝窝; BOM名称: 贴片电容; 下单链接: https://item.taobao.com/item.htm?ft=t&id=613637044352
J1-J6 = Header 5X2: 5*2P接插件; 淘宝ID: 小糖豆的小窝窝; BOM名称: 5*2P接插件; 下单链接: https://item.taobao.com/item.htm?ft=t&id=613637044352
JP3 = Header 7: 7P接插件; 淘宝ID: 小糖豆的小窝窝; BOM名称: 7P接插件; 下单链接: https://item.taobao.com/item.htm?ft=t&id=613637044352
JP4 = Header 4: 4P接插件; 淘宝ID: 小糖豆的小窝窝; BOM名称: 4P接插件; 下单链接: https://item.taobao.com/item.htm?ft=t&id=613637044352
R47-R50 = R: 贴片电阻; 淘宝ID: 小糖豆的小窝窝; BOM名称: 贴片电阻; 下单链接: https://item.taobao.com/item.htm?ft=t&id=613637044352
TP9-TP11 = TEST TP: 测试环; 淘宝ID: 小糖豆的小窝窝; BOM名称: 测试环; 下单链接: https://item.taobao.com/item.htm?ft=t&id=613637044352

## Nets that join several sheets
+3REF: AIO (8 pins), CONDITIONING (6 pins)
+3V3: POWER_OSC_BOOT (60 pins), AIO (FB3.1), DIO (6 pins), CONNECTOR_BUFFER (JP3.2)
+3V3A: POWER_OSC_BOOT (5 pins), AIO (ESD1.5 ESD2.5 ESD3.5 ESD4.5)
+5: POWER_OSC_BOOT (9 pins), CONNECTOR_BUFFER (8 pins)
+12: POWER_OSC_BOOT (JP2.1), CONDITIONING (7 pins)
-12: POWER_OSC_BOOT (JP2.4), CONDITIONING (7 pins)
GND: POWER_OSC_BOOT (67 pins), AIO (37 pins), DIO (12 pins), CONDITIONING (19 pins), CONNECTOR_BUFFER (32 pins)
AA2: CONDITIONING (R22.2 U6.3), CONNECTOR_BUFFER (J2.1)
AA3: CONDITIONING (R23.2 U6.12), CONNECTOR_BUFFER (J5.1)
AB3: CONDITIONING (R21.2 U5.12), CONNECTOR_BUFFER (J1.1)
AC2: CONDITIONING (R18.2 U7.3), CONNECTOR_BUFFER (J3.1)
AC3: CONDITIONING (R19.2 U7.12), CONNECTOR_BUFFER (J6.1)
AD0: CONDITIONING (R20.2 U5.3), CONNECTOR_BUFFER (J4.1)
ADCA2: AIO (RA3.7), CONDITIONING (R34.1 R40.2)
ADCA3: AIO (RA3.6), CONDITIONING (R35.1 R41.2)
ADCA4: AIO (RA3.5), CONNECTOR_BUFFER (J5.3)
ADCA5: AIO (RA4.8), CONNECTOR_BUFFER (J3.3)
ADCB2: AIO (RA2.6), CONNECTOR_BUFFER (J2.3)
ADCB3: AIO (RA2.7), CONDITIONING (R33.1 R39.2)
ADCC2: AIO (RA4.7), CONDITIONING (R30.1 R36.2)
ADCC3: AIO (RA4.6), CONDITIONING (R31.1 R37.2)
ADCC4: AIO (RA4.5), CONNECTOR_BUFFER (J6.3)
ADCD0: AIO (RA2.8), CONDITIONING (R32.1 R38.2)
ADCD1: AIO (RA1.5), CONNECTOR_BUFFER (J4.3)
ADCD2: AIO (RA1.6), CONNECTOR_BUFFER (J4.2)
ADCD3: AIO (RA1.7), CONNECTOR_BUFFER (J1.3)
ADCD4: AIO (RA1.8), CONNECTOR_BUFFER (J1.2)
I2CB_SCL: DIO (U1.71), CONNECTOR_BUFFER (R47.1)
I2CB_SDA: DIO (U1.70), CONNECTOR_BUFFER (R49.1)
nCS: DIO (U1.12), CONNECTOR_BUFFER (JP3.7)
P12: DIO (U1.4), CONNECTOR_BUFFER (BUF3.5)
P13: DIO (U1.5), CONNECTOR_BUFFER (BUF3.4)
P14: DIO (U1.6), CONNECTOR_BUFFER (BUF3.3)
P15: DIO (U1.7), CONNECTOR_BUFFER (JP3.5)
P17: DIO (U1.9), CONNECTOR_BUFFER (JP3.6)
P20: DIO (U1.13), CONNECTOR_BUFFER (BUF2.8)
P21: DIO (U1.14), CONNECTOR_BUFFER (BUF2.7)
P22: DIO (U1.22), CONNECTOR_BUFFER (BUF2.3)
P23: DIO (U1.23), CONNECTOR_BUFFER (BUF2.2)
P24: DIO (U1.24), CONNECTOR_BUFFER (BUF1.9)
P25: DIO (U1.25), CONNECTOR_BUFFER (BUF1.6)
P26: DIO (U1.27), CONNECTOR_BUFFER (BUF1.5)
P27: DIO (U1.28), CONNECTOR_BUFFER (BUF1.4)
P72/BOOT1: POWER_OSC_BOOT (DIP1.2 R45.1), DIO (U1.139)
P84/BOOT0: POWER_OSC_BOOT (DIP1.1 R46.1), DIO (U1.154)
P87: DIO (U1.157), CONNECTOR_BUFFER (BUF4.9)
P88: DIO (U1.170), CONNECTOR_BUFFER (BUF4.8)
P89: DIO (U1.171), CONNECTOR_BUFFER (BUF4.7)
P90: DIO (U1.172), CONNECTOR_BUFFER (BUF4.6)
P91: DIO (U1.173), CONNECTOR_BUFFER (BUF4.5)
P92: DIO (U1.174), CONNECTOR_BUFFER (BUF4.2)
P93: DIO (U1.175), CONNECTOR_BUFFER (BUF3.9)
P94: DIO (U1.176), CONNECTOR_BUFFER (BUF3.8)
P99: DIO (U1.17), CONNECTOR_BUFFER (BUF2.6)
PWM1A: DIO (U1.160), CONNECTOR_BUFFER (BUF2.9)
PWM1B: DIO (U1.161), CONNECTOR_BUFFER (BUF3.2)
PWM2A: DIO (U1.162), CONNECTOR_BUFFER (BUF3.6)
PWM2B: DIO (U1.163), CONNECTOR_BUFFER (BUF3.7)
PWM3A: DIO (U1.164), CONNECTOR_BUFFER (BUF4.3)
PWM3B: DIO (U1.165), CONNECTOR_BUFFER (BUF4.4)
PWM4A: DIO (U1.166), CONNECTOR_BUFFER (BUF1.2)
PWM4B: DIO (U1.167), CONNECTOR_BUFFER (BUF1.3)
PWM5A: DIO (U1.18), CONNECTOR_BUFFER (BUF1.7)
PWM5B: DIO (U1.19), CONNECTOR_BUFFER (BUF1.8)
PWM6A: DIO (U1.1), CONNECTOR_BUFFER (BUF2.4)
PWM6B: DIO (U1.2), CONNECTOR_BUFFER (BUF2.5)
SCI_RX: POWER_OSC_BOOT (JP1.13), DIO (U1.131)
SCI_TX: POWER_OSC_BOOT (JP1.14), DIO (U1.130)
SPIA_SCK: DIO (U1.10), CONNECTOR_BUFFER (R48.2)
SPIA_SDA: DIO (U1.8), CONNECTOR_BUFFER (R50.2)